# EAGLE design Airsensor (EAGLE 7.3.0)
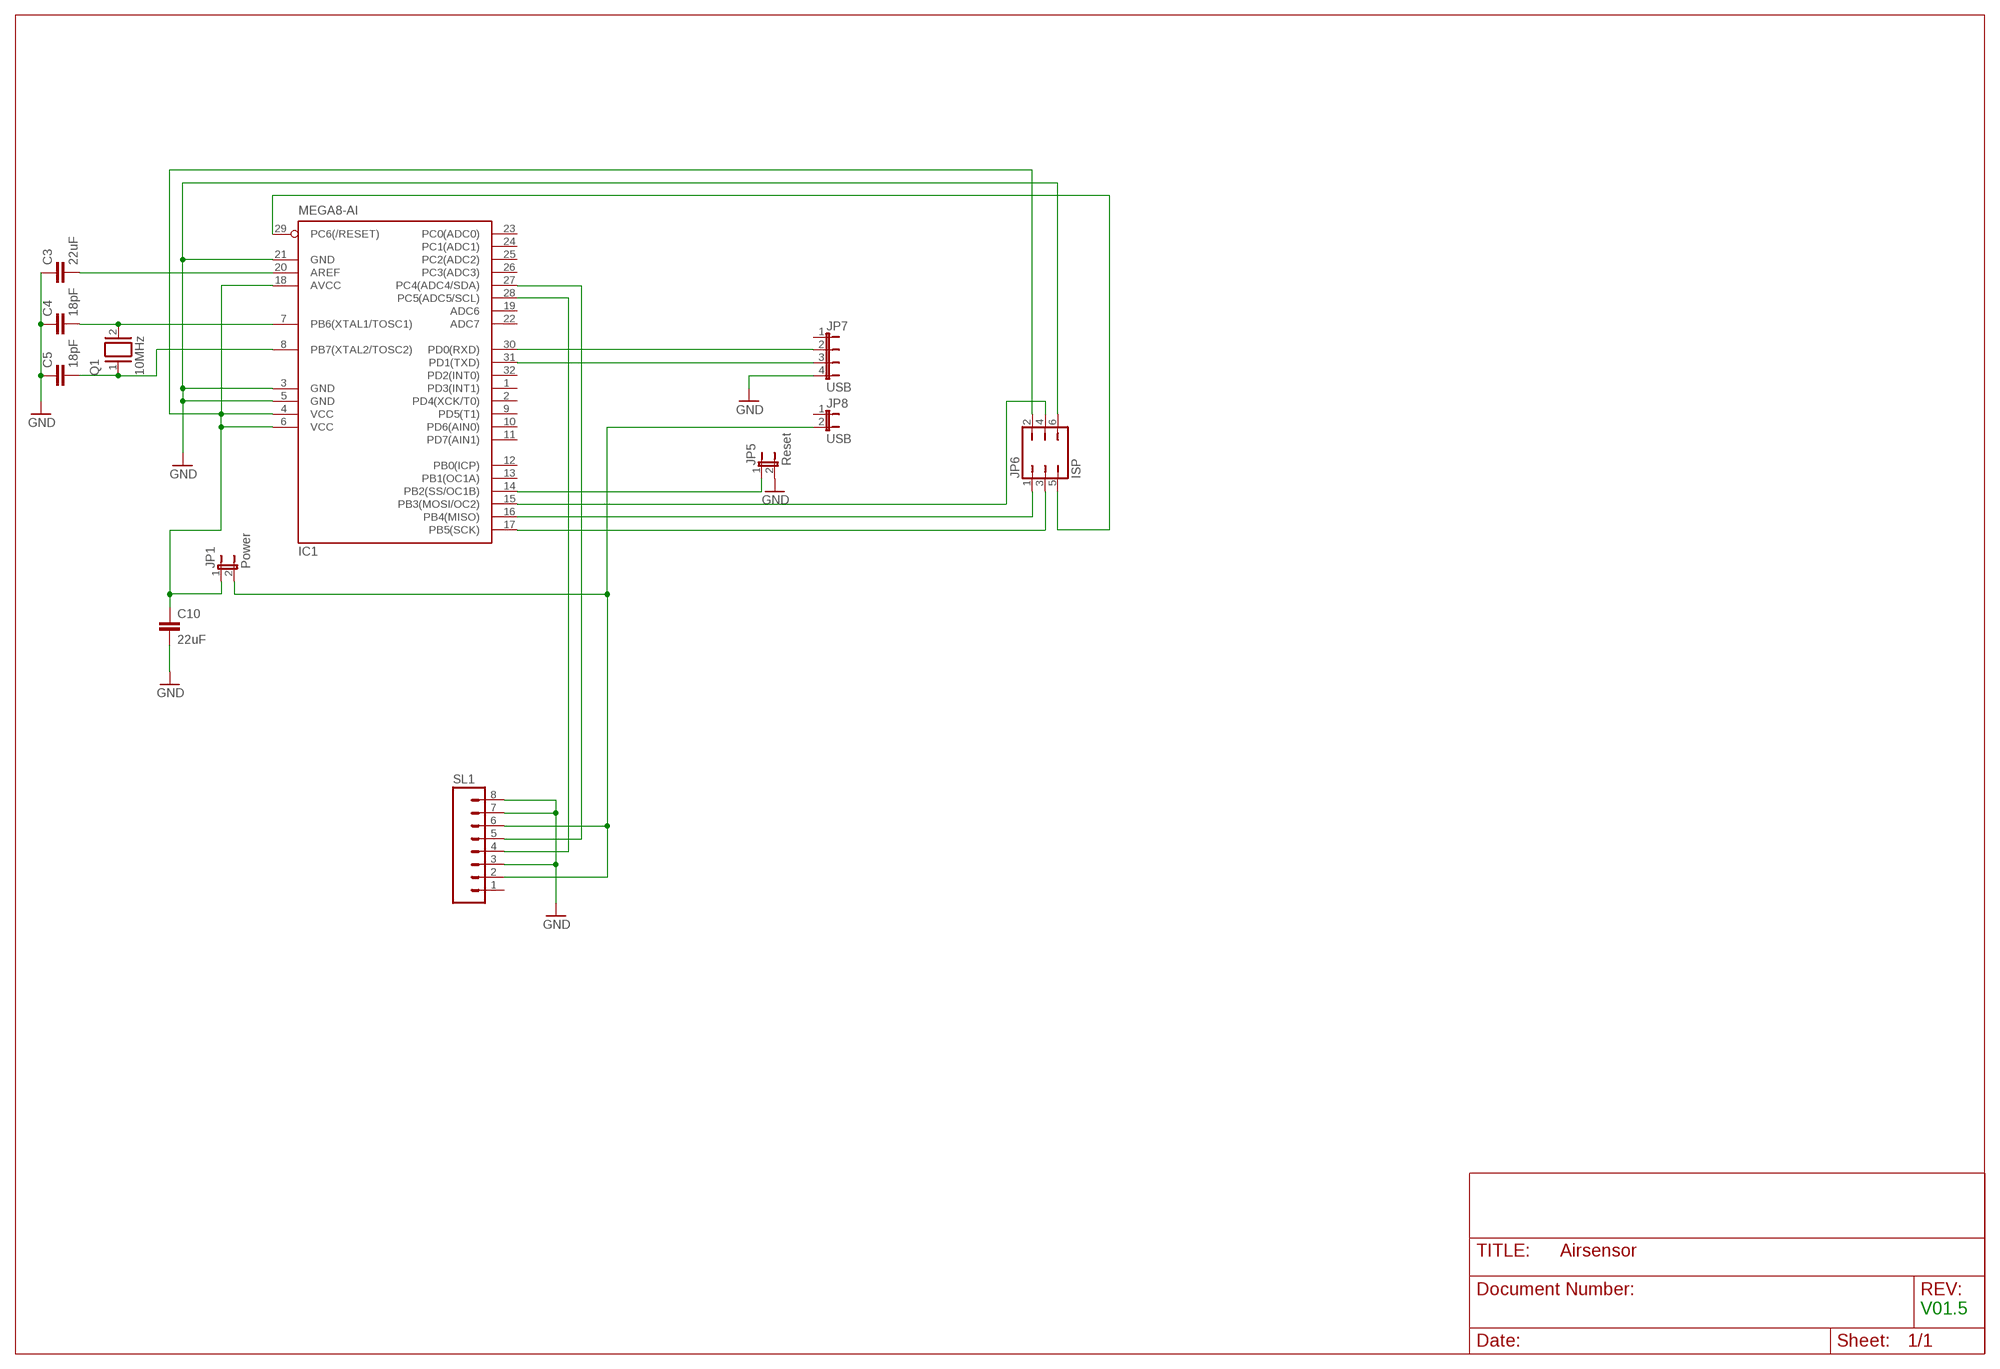
[diagram p0: schematic, sheet 1]

## Parts
C3  22uF  C-EUC1206  [C1206]
C4  18pF  C-EU025-025X050  [C025-025X050]
C5  18pF  C-EU025-025X050  [C025-025X050]
C10  22uF  C-EUC1206  [C1206]
IC1  MEGA8-AI  [TQFP32-08]
JP1  Power  JP1E  [JP1]
JP5  Reset  JP1E  [JP1]
JP6  ISP  JP3Q  [JP3Q]
JP7  USB  JP4E  [JP4]
JP8  USB  JP1E  [JP1]
Q1  10MHz  XTAL/S  [QS]
SL1  M08  [08P]

## Nets
GND: C3.1 C4.1 C5.1 C10.2 IC1.3(GND) IC1.5(GND) IC1.21(GND) JP5.2 JP6.6 JP7.4 SL1.3 SL1.7 SL1.8
N$1: IC1.28(PC5(ADC5/SCL)) SL1.4
N$2: IC1.15(PB3(MOSI/OC2)) JP6.4
N$3: JP1.2 JP8.2 SL1.2 SL1.6
N$8: IC1.17(PB5(SCK)) JP6.3
N$10: IC1.31(PD1(TXD)) JP7.3
N$11: IC1.14(PB2(SS/OC1B)) JP5.1
N$12: IC1.27(PC4(ADC4/SDA)) SL1.5
N$13: C3.2 IC1.20(AREF)
N$15: IC1.16(PB4(MISO)) JP6.1
N$18: IC1.29(PC6(/RESET)) JP6.5
N$19: C4.2 IC1.7(PB6(XTAL1/TOSC1)) Q1.2
N$26: C10.1 IC1.4(VCC) IC1.6(VCC) IC1.18(AVCC) JP1.1 JP6.2
N$28: IC1.30(PD0(RXD)) JP7.2
N$37: C5.2 IC1.8(PB7(XTAL2/TOSC2)) Q1.1
Unconnected: IC1.1(PD3(INT1)) IC1.2(PD4(XCK/T0)) IC1.9(PD5(T1)) IC1.10(PD6(AIN0)) IC1.11(PD7(AIN1)) IC1.12(PB0(ICP)) IC1.13(PB1(OC1A)) IC1.19(ADC6) IC1.22(ADC7) IC1.23(PC0(ADC0)) IC1.24(PC1(ADC1)) IC1.25(PC2(ADC2)) IC1.26(PC3(ADC3)) IC1.32(PD2(INT0)) JP7.1 JP8.1 SL1.1

## Notes on the sheet
- V01.5

## Library data of the parts
C3 C10 = rcl:C-EU: CAPACITOR, European symbol
C4 C5 = resistor:C-EU: CAPACITOR, European symbol
IC1 = atmel:MEGA8: MICROCONTROLLER 8 Kbytes FLASH, 1 kbytes SRAM, 512 bytes EEPROM, USART, 6-channel 10 bit ADC, 2-channel 8 bit ADC Pin compatible with Atmega48, ATMega88, ATMega168 Source: avr.lbr; MPN: ATMEGA8-16AU; OC_FARNELL: 9171371; OC_NEWARK: 73M8863
JP1 JP5 JP8 = jumper:JP1E: JUMPER
JP6 = jumper:JP3Q: JUMPER
JP7 = jumper:JP4E: JUMPER
Q1 = special:XTAL/S: CRYSTAL
SL1 = con-amp-quick:M08: AMP QUICK CONNECTOR; OC_FARNELL: unknown; OC_NEWARK: unknown

## Board
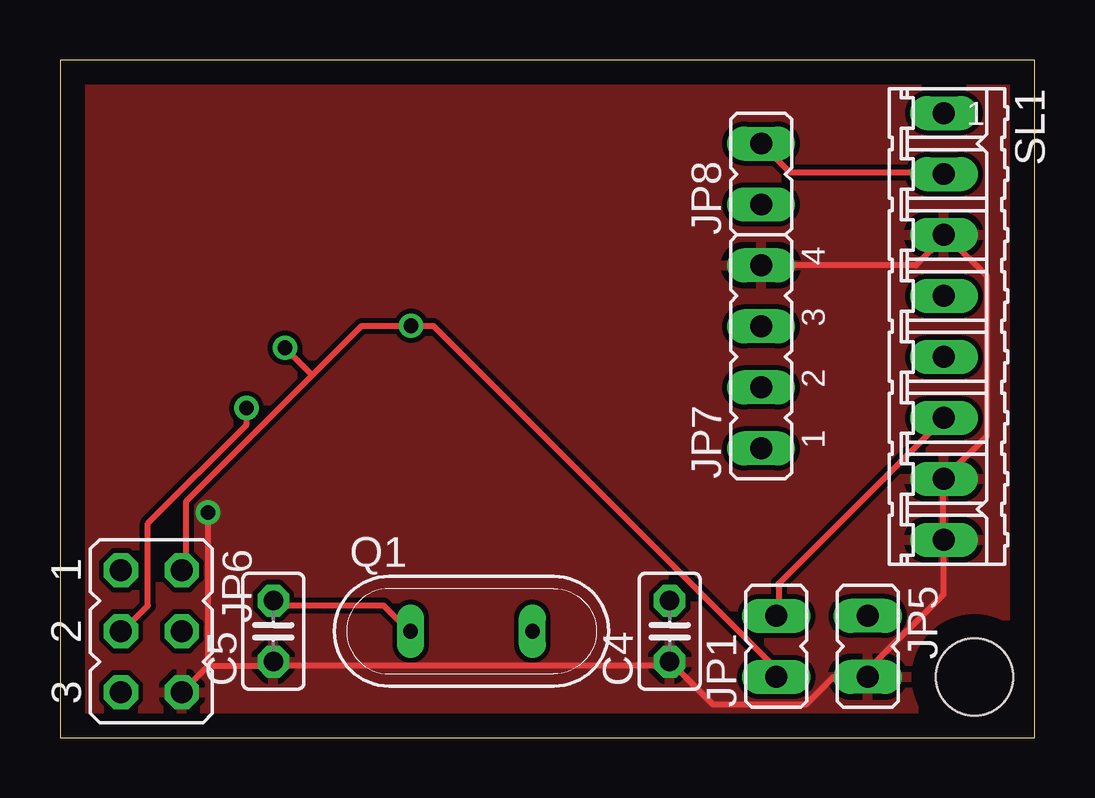
[diagram p1: board, top side]
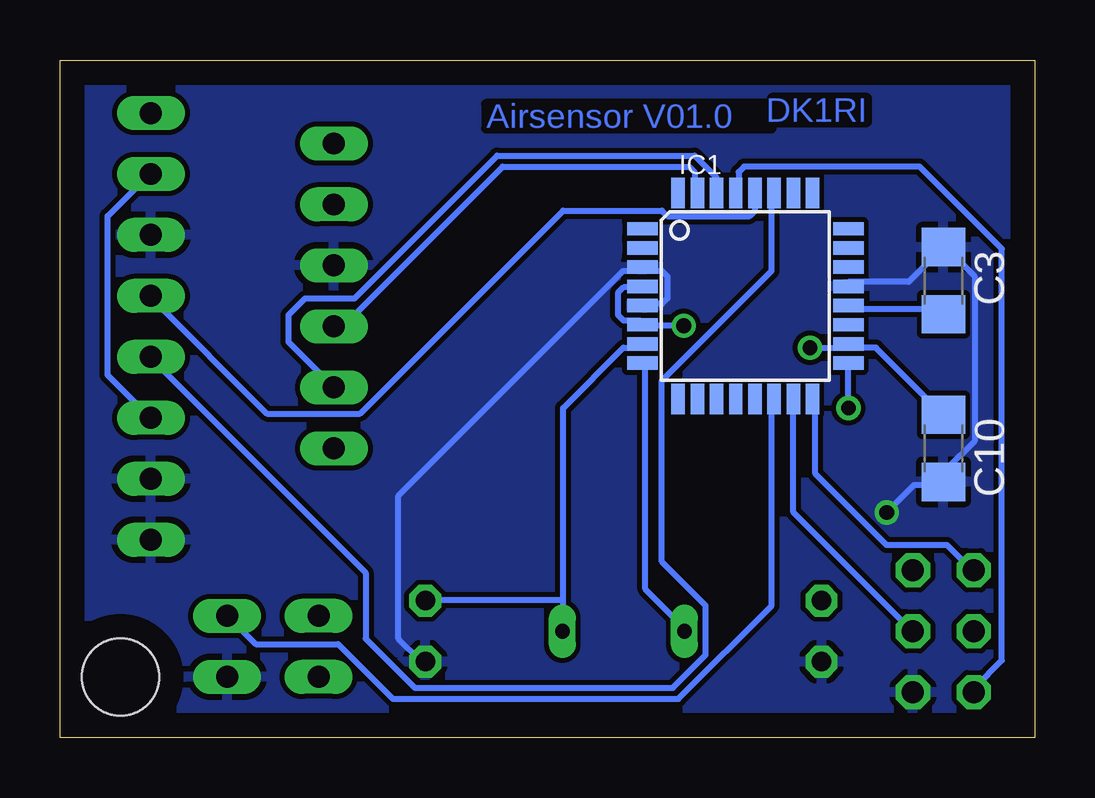
[diagram p2: board, bottom side, seen from below]

Size 40.62 x 28.25 mm. Coordinates in mm from the lower left corner, seen from the top.
Outline: 0,0 40.62,0 40.62,28.25 0,28.25 0,0
Copper layers (1*16): Top 0.035mm / dielectric 1.5mm / Bottom 0.035mm
Design rules "default": minimum track width 10mil, minimum drill 24mil, track to track 8mil, track to pad 8mil, pad to pad 8mil, via to via 8mil, smd to smd 8mil, copper to edge 40mil, drill to drill 8mil, minimum pad ring 10mil, minimum via ring 8mil, stop-mask expansion 4mil, vias tented up to drill 0mil, thermal gap 10mil
Holes 3.2 mm at 38.1,2.54

### Footprints (pad centres in the part's own frame; a part is rotated, then mirrored left to right if it is on the bottom)
C1206 = smd 1.6 x 1.8: 1 -1.4,0; 2 1.4,0
C025-025X050 = drill 0.813 octagon: 1 -1.27,0; 2 1.27,0
TQFP32-08 = smd 1.27 x 0.559: 1 -4.293,2.8; 2 -4.293,2; 3 -4.293,1.2; 4 -4.293,0.4; 5 -4.293,-0.4; 6 -4.293,-1.2; 7 -4.293,-2; 8 -4.293,-2.8; 17 4.293,-2.8; 18 4.293,-2; 19 4.293,-1.2; 20 4.293,-0.4; 21 4.293,0.4; 22 4.293,1.2; 23 4.293,2; 24 4.293,2.8 | smd 0.559 x 1.27: 9 -2.8,-4.293; 10 -2,-4.293; 11 -1.2,-4.293; 12 -0.4,-4.293; 13 0.4,-4.293; 14 1.2,-4.293; 15 2,-4.293; 16 2.8,-4.293; 25 2.8,4.293; 26 2,4.293; 27 1.2,4.293; 28 0.4,4.293; 29 -0.4,4.293; 30 -1.2,4.293; 31 -2,4.293; 32 -2.8,4.293
JP1 = drill 0.914 long: 1 0,-1.27; 2 0,1.27
JP3Q = drill 0.914 octagon: 1 -2.54,-1.27; 2 -2.54,1.27; 3 0,-1.27; 4 0,1.27; 5 2.54,-1.27; 6 2.54,1.27
JP4 = drill 0.914 long: 1 -3.81,0; 2 -1.27,0; 3 1.27,0; 4 3.81,0
QS = drill 0.61 long: 1 -2.54,0; 2 2.54,0
08P = drill 0.914 long: 1 -8.89,0; 2 -6.35,0; 3 -3.81,0; 4 -1.27,0; 5 1.27,0; 6 3.81,0; 7 6.35,0; 8 8.89,0

### Placement (x,y rotation side)
C3  3.81,19.05 270 bottom
C4  25.4,4.45 90 top
C5  8.89,4.45 90 top
C10  3.81,12.07 270 bottom
IC1  12.06,18.42 0 bottom
JP1  29.84,3.81 0 top
JP5  33.66,3.81 180 top
JP6  3.81,4.45 270 top
JP7  29.21,15.88 90 top
JP8  29.21,23.5 0 top
Q1  17.14,4.45 0 top
SL1  36.83,17.14 270 top

### Tracks (layer width: path | path; a pad name or v marks a point on that pad's centre or on a via)
GND  (via drill 0.61)
  Top 0.254: JP7.4 35.66,19.68 36.8,20.83 SL1.3 37.03,20.83 38.63,19.23 38.63,12.6 SL1.7 36.8,10.77 36.8,8.25 | 36.8,8.25 36.8,5.97 33.83,3 33.83,2.54 JP5.2 32.23,2.54 31.09,1.4 27.2,1.4 25.6,3 C4.1 25.38,3 8.91,3 C5.1 8.69,3 6.17,3 | 36.8,8.25 SL1.8 | JP6.6 6.17,3 | 6.17,3 v6.17,9.4
  Bottom 0.254: IC1.21 7.77,19 5.26,19 3.89,20.37 C3.1 3.66,20.37 2.52,19.23 2.52,12.37 3.66,11.23 3.66,10.77 C10.2 3.89,10.54 5.03,10.54 v6.17,9.4 | IC1.5 16.23,18.08 15.54,18.08 15.32,18.31 15.32,19.23 15.54,19.46 16.23,19.46 IC1.3 16.46,19.46 17.14,19.46 26.52,10.08 26.52,4.14 25.6,3.23 C4.1
  pour Top: 0.64,27.3 40.01,27.3 40.01,0.63 0.64,0.63
  pour Bottom: 0.64,27.3 40.01,27.3 40.01,0.63 0.64,0.63
N$1
  Bottom 0.254: IC1.28 11.66,22.66 11.66,21.97 11.89,21.74 15.32,21.74 15.54,21.97 19.66,21.97 28.12,13.51 32,13.51 36.8,18.31 SL1.4
N$2
  Bottom 0.254: IC1.15 10.06,13.97 10.06,9.4 5.26,4.6 JP6.4
N$3
  Top 0.254: JP8.2 30.4,23.57 36.8,23.57 SL1.2 | JP1.2 29.95,5.28 29.95,6.43 36.8,13.28 SL1.6
  Bottom 0.254: SL1.2 37.03,23.34 38.63,21.74 38.63,15.11 37.03,13.51 SL1.6
N$8  (via drill 0.61)
  Top 0.254: v7.77,13.74 7.77,13.06 3.66,8.94 3.66,5.51 2.74,4.6 JP6.3
  Bottom 0.254: v7.77,13.74 IC1.17
N$10
  Bottom 0.254: IC1.31 14.17,22.89 14.17,23.57 14.4,23.8 22.17,23.8 29.03,16.94 JP7.3
N$11
  Bottom 0.254: IC1.14 10.97,13.97 10.97,5.51 14.86,1.63 26.75,1.63 29.03,3.91 32.46,3.91 33.6,5.05 JP5.1
N$12
  Bottom 0.254: IC1.27 10.97,22.66 10.97,19.46 15.54,14.88 15.54,7.34 13.72,5.51 13.72,3.45 15.09,2.08 25.83,2.08 27.89,4.14 27.89,6.88 36.8,15.8 SL1.5
N$13
  Bottom 0.254: IC1.20 7.77,17.86 3.89,17.86 C3.2
N$15
  Bottom 0.254: IC1.16 9.14,13.97 9.14,11 6.17,8.03 3.66,8.03 2.74,7.11 JP6.1
N$18
  Bottom 0.254: IC1.29 12.34,22.89 12.34,23.57 12.12,23.8 4.8,23.8 1.37,20.37 1.37,3.23 2.52,2.08 JP6.5
N$19
  Bottom 0.254: 19.66,5.74 19.66,4.6 Q1.2 | 19.66,5.74 19.66,13.74 17.14,16.26 16.46,16.26 IC1.7 | 19.66,5.74 25.38,5.74 C4.2
N$26  (via drill 0.61)
  Top 0.254: 10.52,15.11 5.26,9.86 5.26,7.11 JP6.2 | 10.52,15.11 12.57,17.17 v14.63,17.17 15.54,17.17 29.72,3 29.72,2.54 JP1.1 | 10.52,15.11 v9.37,16.26
  Bottom 0.254: 7.77,16.26 6.63,16.26 3.89,13.51 C10.1 | IC1.4 16.46,18.77 17.14,18.77 17.37,18.54 17.37,17.63 17.14,17.4 16.46,17.4 IC1.6 16.23,17.17 v14.63,17.17 | v9.37,16.26 7.77,16.26 | 7.77,16.26 IC1.18
N$28
  Bottom 0.254: JP7.2 31.09,16.48 31.09,17.63 30.4,18.31 28.35,18.31 22.4,24.26 14.17,24.26 13.26,23.34 13.26,22.89 IC1.30
N$37
  Top 0.254: C5.2 8.91,5.51 13.49,5.51 14.4,4.6 Q1.1
  Bottom 0.254: IC1.8 16.23,15.57 16.23,6.2 14.63,4.6 Q1.1

### Text on the board
Bottom: DK1RI | Airsensor V01.0